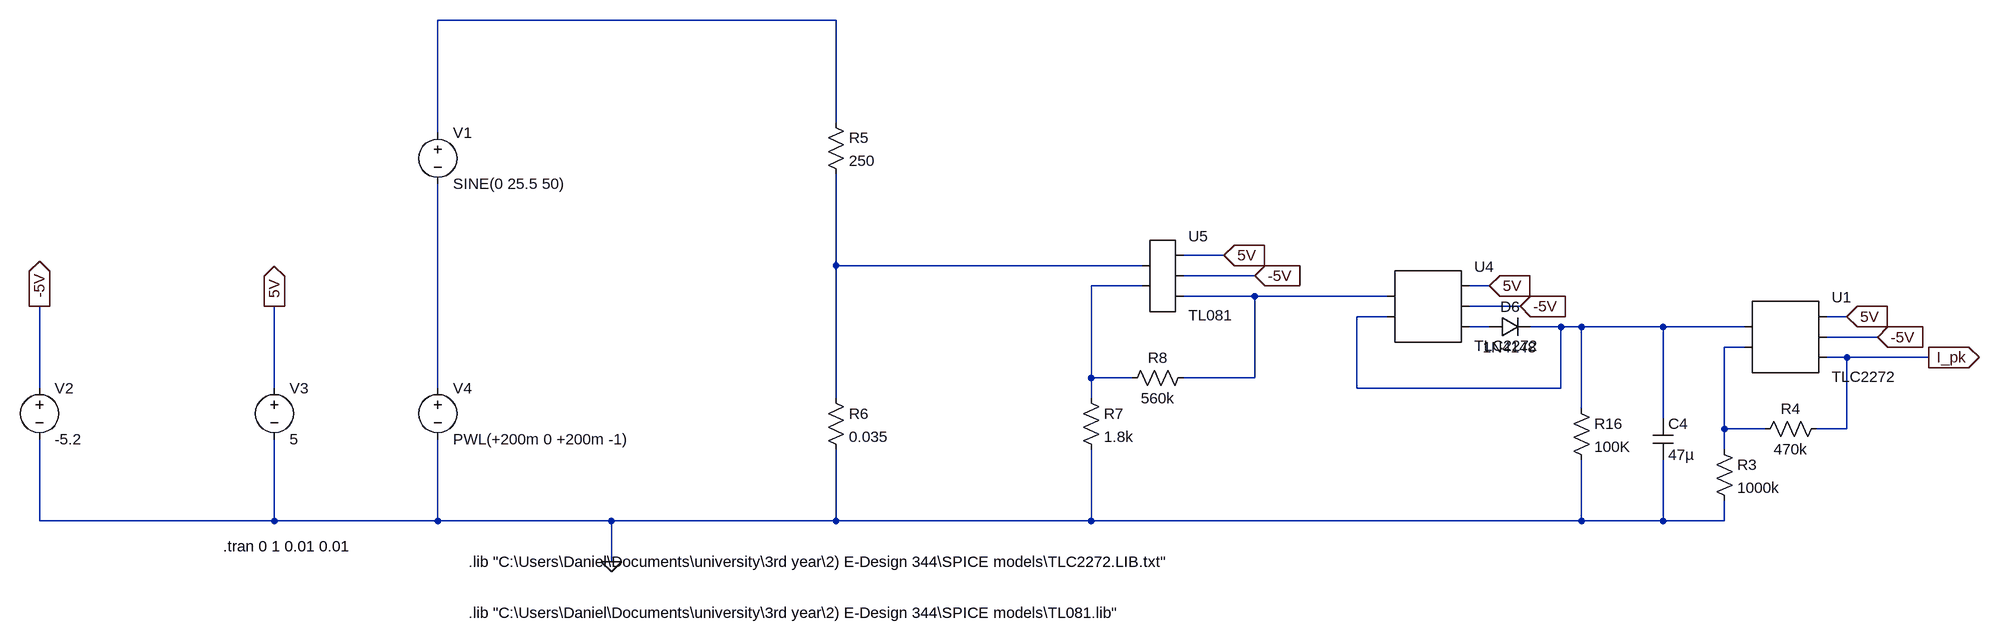
[diagram p0: schematic CurrentTransducer.asc]
CurrentTransducer.asc, the LTspice schematic file:
Version 4
SHEET 1 6112 1424
WIRE 80 480 -544 480
WIRE 80 640 80 480
WIRE -544 656 -544 480
WIRE 688 848 624 848
WIRE 80 864 80 720
WIRE 560 864 80 864
WIRE 736 880 624 880
WIRE 560 896 480 896
WIRE 1104 896 1072 896
WIRE 736 912 624 912
WIRE 944 912 736 912
WIRE 1152 928 1072 928
WIRE 944 944 896 944
WIRE 1664 944 1632 944
WIRE 1104 960 1072 960
WIRE 1216 960 1168 960
WIRE 1248 960 1216 960
WIRE 1376 960 1248 960
WIRE 1504 960 1376 960
WIRE 1712 976 1632 976
WIRE 1504 992 1472 992
WIRE 1664 1008 1632 1008
WIRE 1792 1008 1664 1008
WIRE 480 1040 480 896
WIRE 544 1040 480 1040
WIRE 736 1040 736 912
WIRE 736 1040 624 1040
WIRE -1168 1056 -1168 928
WIRE -800 1056 -800 928
WIRE -544 1056 -544 736
WIRE 896 1056 896 944
WIRE 1216 1056 1216 960
WIRE 1216 1056 896 1056
WIRE 80 1072 80 864
WIRE 480 1072 480 1040
WIRE 1248 1088 1248 960
WIRE 1376 1104 1376 960
WIRE 1472 1120 1472 992
WIRE 1536 1120 1472 1120
WIRE 1664 1120 1664 1008
WIRE 1664 1120 1616 1120
WIRE 1472 1152 1472 1120
WIRE -1168 1264 -1168 1136
WIRE -800 1264 -800 1136
WIRE -800 1264 -1168 1264
WIRE -544 1264 -544 1136
WIRE -544 1264 -800 1264
WIRE -272 1264 -544 1264
WIRE 80 1264 80 1152
WIRE 80 1264 -272 1264
WIRE 480 1264 480 1152
WIRE 480 1264 80 1264
WIRE 1248 1264 1248 1168
WIRE 1248 1264 480 1264
WIRE 1376 1264 1376 1168
WIRE 1376 1264 1248 1264
WIRE 1472 1264 1472 1232
WIRE 1472 1264 1376 1264
WIRE -272 1328 -272 1264
FLAG -272 1328 0
FLAG -800 928 5V
IOPIN -800 928 Out
FLAG -1168 928 -5V
IOPIN -1168 928 Out
FLAG 736 880 -5V
IOPIN 736 880 In
FLAG 688 848 5V
IOPIN 688 848 In
FLAG 1152 928 -5V
IOPIN 1152 928 In
FLAG 1712 976 -5V
IOPIN 1712 976 In
FLAG 1104 896 5V
IOPIN 1104 896 In
FLAG 1664 944 5V
IOPIN 1664 944 In
FLAG 1792 1008 I_pk
IOPIN 1792 1008 Out
SYMBOL voltage -1168 1040 R0
WINDOW 123 0 0 Left 2
WINDOW 39 0 0 Left 2
SYMATTR InstName V2
SYMATTR Value -5.2
SYMBOL voltage -800 1040 R0
WINDOW 123 0 0 Left 2
WINDOW 39 0 0 Left 2
SYMATTR InstName V3
SYMATTR Value 5
SYMBOL res 64 624 R0
SYMATTR InstName R5
SYMATTR Value 250
SYMBOL res 64 1056 R0
SYMATTR InstName R6
SYMATTR Value 0.035
SYMBOL res 464 1056 R0
SYMATTR InstName R7
SYMATTR Value 1.8k
SYMBOL res 528 1056 R270
WINDOW 0 32 56 VTop 2
WINDOW 3 0 56 VBottom 2
SYMATTR InstName R8
SYMATTR Value 560k
SYMBOL cap 1360 1104 R0
SYMATTR InstName C4
SYMATTR Value 47µ
SYMBOL diode 1104 976 R270
WINDOW 0 32 32 VTop 2
WINDOW 3 0 32 VBottom 2
SYMATTR InstName D6
SYMATTR Value 1N4148
SYMBOL res 1232 1072 R0
SYMATTR InstName R16
SYMATTR Value 100K
SYMBOL res 1456 1136 R0
SYMATTR InstName R3
SYMATTR Value 1000k
SYMBOL res 1520 1136 R270
WINDOW 0 32 56 VTop 2
WINDOW 3 0 56 VBottom 2
SYMATTR InstName R4
SYMATTR Value 470k
SYMBOL AutoGenerated\\TLC2272 1568 976 R0
SYMATTR InstName U1
SYMBOL AutoGenerated\\TLC2272 1008 928 R0
SYMATTR InstName U4
SYMBOL AutoGenerated\\TL081 592 880 R0
SYMATTR InstName U5
SYMBOL voltage -544 640 R0
WINDOW 123 0 0 Left 2
WINDOW 39 0 0 Left 2
SYMATTR InstName V1
SYMATTR Value SINE(0 25.5 50)
SYMBOL voltage -544 1040 R0
WINDOW 123 0 0 Left 2
WINDOW 39 0 0 Left 2
SYMATTR InstName V4
SYMATTR Value PWL(+200m 0 +200m -1)
TEXT -880 1304 Left 2 !.tran 0 1 0.01 0.01
TEXT -496 1328 Left 2 !.lib "C:\\Users\\Daniel\\Documents\\university\\3rd year\\2) E-Design 344\\SPICE models\\TLC2272.LIB.txt"
TEXT -496 1408 Left 2 !.lib "C:\\Users\\Daniel\\Documents\\university\\3rd year\\2) E-Design 344\\SPICE models\\TL081.lib"

The netlist it stands for:
* CurrentTransducer.asc
V2 -5V 0 -5.2
V3 5V 0 5
R5 N001 N002 250
R6 N002 0 0.035
R7 N003 0 1.8k
R8 N003 N004 560k
C4 N005 0 47µ
D6 N006 N005 1N4148
R16 N005 0 100K
R3 N007 0 1000k
R4 N007 I_pk 470k
* U1: TLC2272 (symbol AutoGenerated\TLC2272 not available, pins judged from their places): pin1=N005 pin2=N007 pin3=5V pin4=-5V pin5=I_pk
* U4: TLC2272 (symbol AutoGenerated\TLC2272 not available, pins judged from their places): pin1=N004 pin2=N005 pin3=5V pin4=-5V pin5=N006
* U5: TL081 (symbol AutoGenerated\TL081 not available, pins judged from their places): pin1=N002 pin2=N003 pin3=5V pin4=-5V pin5=N004
V1 N001 N008 SINE(0 25.5 50)
V4 N008 0 PWL(+200m 0 +200m -1)
.model D D
.lib standard.dio
.tran 0 1 0.01 0.01
.lib "C:\Users\Daniel\Documents\university\3rd year\2) E-Design 344\SPICE models\TLC2272.LIB.txt"
.lib "C:\Users\Daniel\Documents\university\3rd year\2) E-Design 344\SPICE models\TL081.lib"
.backanno
.end